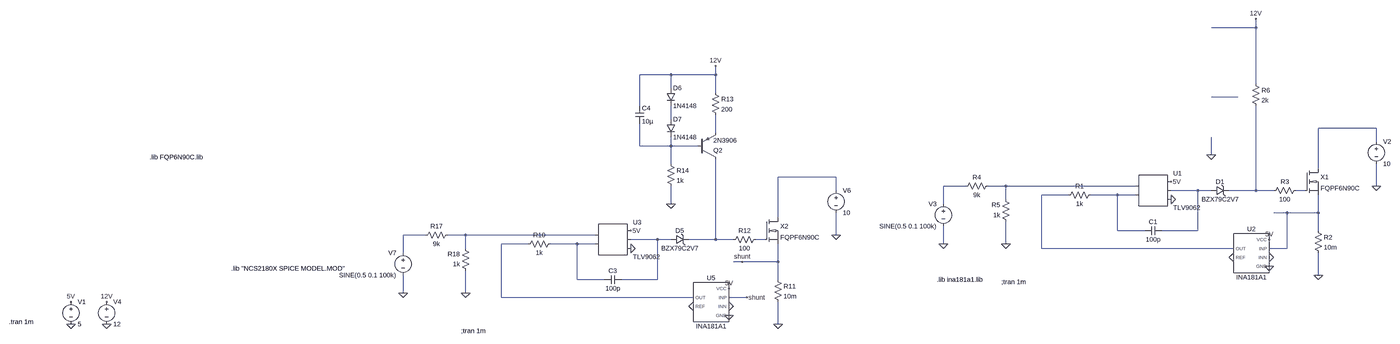
[diagram p0: schematic ina181.asc, whole sheet]
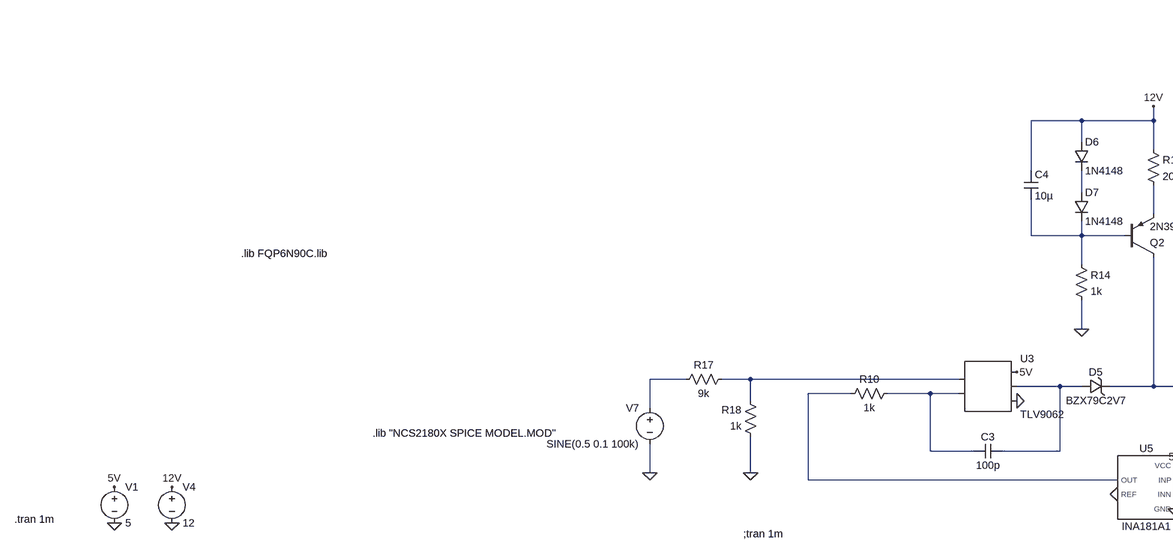
[diagram p1: schematic ina181.asc, part, row 1 of 1, column 1 of 2]
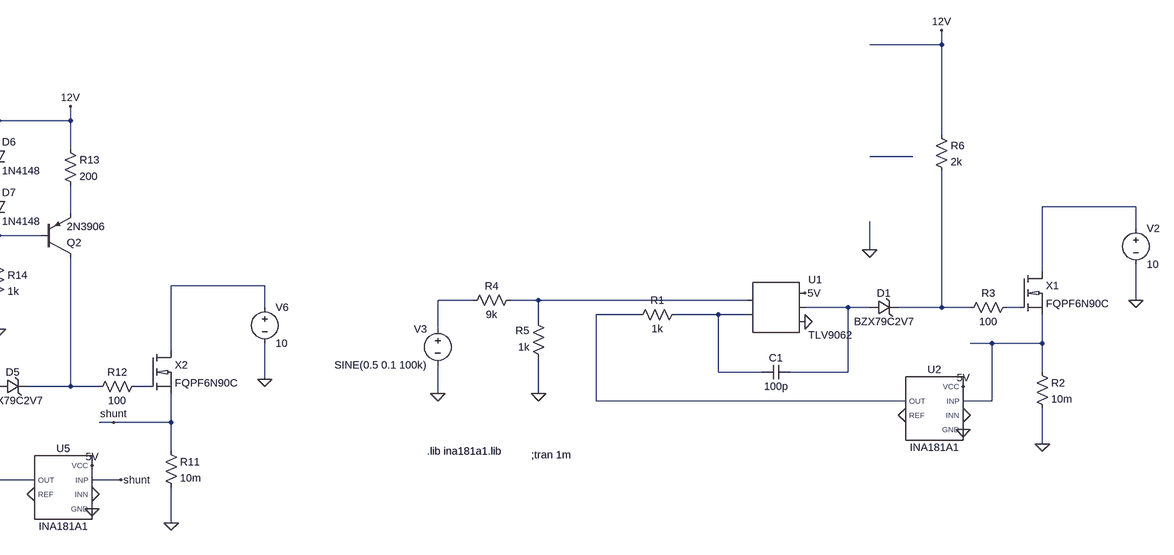
[diagram p2: schematic ina181.asc, part, row 1 of 1, column 2 of 2]
ina181.asc, the LTspice schematic file:
Version 4
SHEET 1 6072 916
WIRE 5584 -560 5584 -592
WIRE 5584 -560 5424 -560
WIRE 3344 -384 3232 -384
WIRE 3504 -384 3504 -416
WIRE 3504 -384 3344 -384
WIRE 5584 -352 5584 -560
WIRE 3344 -336 3344 -384
WIRE 3504 -320 3504 -384
WIRE 5520 -304 5424 -304
WIRE 3232 -272 3232 -384
WIRE 3344 -224 3344 -272
WIRE 6016 -192 5808 -192
WIRE 3504 -176 3504 -240
WIRE 6016 -144 6016 -192
WIRE 3232 -128 3232 -208
WIRE 3344 -128 3344 -160
WIRE 3344 -128 3232 -128
WIRE 3440 -128 3344 -128
WIRE 5424 -96 5424 -160
WIRE 3344 -64 3344 -128
WIRE 5808 -48 5808 -192
WIRE 3936 -16 3728 -16
WIRE 4544 16 4464 16
WIRE 4688 16 4624 16
WIRE 5152 16 4688 16
WIRE 6016 16 6016 -64
WIRE 3936 32 3936 -16
WIRE 5376 32 5280 32
WIRE 5424 32 5376 32
WIRE 5584 32 5584 -272
WIRE 5584 32 5488 32
WIRE 5648 32 5584 32
WIRE 5760 32 5728 32
WIRE 4912 48 4816 48
WIRE 5088 48 4992 48
WIRE 5152 48 5088 48
WIRE 4688 64 4688 16
WIRE 3344 80 3344 16
WIRE 4464 80 4464 16
WIRE 5696 112 5648 112
WIRE 5808 112 5808 48
WIRE 5808 112 5696 112
WIRE 3728 128 3728 -16
WIRE 5088 176 5088 48
WIRE 5184 176 5088 176
WIRE 5376 176 5376 32
WIRE 5376 176 5248 176
WIRE 5808 176 5808 112
WIRE 2464 192 2384 192
WIRE 2608 192 2544 192
WIRE 3072 192 2608 192
WIRE 3936 192 3936 112
WIRE 3296 208 3200 208
WIRE 3344 208 3296 208
WIRE 3504 208 3504 -80
WIRE 3504 208 3408 208
WIRE 3568 208 3504 208
WIRE 3680 208 3648 208
WIRE 2832 224 2736 224
WIRE 3008 224 2912 224
WIRE 3072 224 3008 224
WIRE 4464 224 4464 160
WIRE 4688 224 4688 144
WIRE 2608 240 2608 192
WIRE 4816 240 4816 48
WIRE 5504 240 4816 240
WIRE 5696 240 5696 112
WIRE 5696 240 5632 240
WIRE 2384 256 2384 192
WIRE 3600 288 3568 288
WIRE 3728 288 3728 224
WIRE 3728 288 3600 288
WIRE 5808 336 5808 256
WIRE 3008 352 3008 224
WIRE 3104 352 3008 352
WIRE 3296 352 3296 208
WIRE 3296 352 3168 352
WIRE 3728 352 3728 288
WIRE 2384 400 2384 336
WIRE 2608 400 2608 320
WIRE 2736 416 2736 224
WIRE 3424 416 2736 416
WIRE 3616 416 3552 416
WIRE 3728 512 3728 432
FLAG 480 432 5V
FLAG 480 512 0
FLAG 608 432 12V
FLAG 608 512 0
FLAG 3728 512 0
FLAG 3936 192 0
FLAG 3600 288 shunt
FLAG 2384 400 0
FLAG 3616 416 shunt
FLAG 3552 384 5V
FLAG 2608 400 0
FLAG 3552 448 0
FLAG 3552 480 0
FLAG 3424 448 0
FLAG 3200 240 0
FLAG 3200 176 5V
FLAG 3504 -416 12V
FLAG 3344 80 0
FLAG 5808 336 0
FLAG 6016 16 0
FLAG 4464 224 0
FLAG 5632 208 5V
FLAG 4688 224 0
FLAG 5632 272 0
FLAG 5632 304 0
FLAG 5504 272 0
FLAG 5280 64 0
FLAG 5280 0 5V
FLAG 5584 -592 12V
FLAG 5424 -96 0
SYMBOL voltage 480 416 R0
WINDOW 123 0 0 Left 0
WINDOW 39 0 0 Left 0
SYMATTR InstName V1
SYMATTR Value 5
SYMBOL voltage 608 416 R0
WINDOW 123 0 0 Left 0
WINDOW 39 0 0 Left 0
SYMATTR InstName V4
SYMATTR Value 12
SYMBOL AutoGenerated\\TLV9062 3136 208 R0
SYMATTR InstName U3
SYMBOL res 2928 208 R90
WINDOW 0 0 56 VBottom 2
WINDOW 3 32 56 VTop 2
SYMATTR InstName R10
SYMATTR Value 1k
SYMBOL cap 3168 336 R90
WINDOW 0 0 32 VBottom 2
WINDOW 3 32 32 VTop 2
SYMATTR InstName C3
SYMATTR Value 100p
SYMBOL res 3712 336 R0
SYMATTR InstName R11
SYMATTR Value 10m
SYMBOL voltage 3936 16 R0
WINDOW 123 0 0 Left 0
WINDOW 39 0 0 Left 0
SYMATTR InstName V6
SYMATTR Value 10
SYMBOL voltage 2384 240 M0
WINDOW 123 0 0 Left 0
WINDOW 39 0 0 Left 0
SYMATTR InstName V7
SYMATTR Value SINE(0.5 0.1 100k)
SYMBOL n_channel_mosfet 3680 128 R0
SYMATTR InstName X2
SYMBOL res 3664 192 R90
WINDOW 0 0 56 VBottom 2
WINDOW 3 32 56 VTop 2
SYMATTR InstName R12
SYMATTR Value 100
SYMBOL res 2560 176 R90
WINDOW 0 0 56 VBottom 2
WINDOW 3 32 56 VTop 2
SYMATTR InstName R17
SYMATTR Value 9k
SYMBOL res 2624 336 R180
WINDOW 0 36 76 Left 2
WINDOW 3 36 40 Left 2
SYMATTR InstName R18
SYMATTR Value 1k
SYMBOL INA181A1 3488 448 M0
SYMATTR InstName U5
SYMBOL zener 3344 224 R270
WINDOW 0 32 32 VTop 2
WINDOW 3 0 32 VBottom 2
SYMATTR InstName D5
SYMATTR Value BZX79C2V7
SYMATTR Description Diode
SYMATTR Type diode
SYMBOL pnp 3440 -80 M180
SYMATTR InstName Q2
SYMATTR Value 2N3906
SYMBOL res 3488 -336 R0
SYMATTR InstName R13
SYMATTR Value 200
SYMBOL diode 3328 -336 R0
SYMATTR InstName D6
SYMATTR Value 1N4148
SYMBOL diode 3328 -224 R0
SYMATTR InstName D7
SYMATTR Value 1N4148
SYMBOL cap 3216 -272 R0
SYMATTR InstName C4
SYMATTR Value 10µ
SYMBOL res 3328 -80 R0
SYMATTR InstName R14
SYMATTR Value 1k
SYMBOL AutoGenerated\\TLV9062 5216 32 R0
SYMATTR InstName U1
SYMBOL res 5008 32 R90
WINDOW 0 0 56 VBottom 2
WINDOW 3 32 56 VTop 2
SYMATTR InstName R1
SYMATTR Value 1k
SYMBOL cap 5248 160 R90
WINDOW 0 0 32 VBottom 2
WINDOW 3 32 32 VTop 2
SYMATTR InstName C1
SYMATTR Value 100p
SYMBOL res 5792 160 R0
SYMATTR InstName R2
SYMATTR Value 10m
SYMBOL voltage 6016 -160 R0
WINDOW 123 0 0 Left 0
WINDOW 39 0 0 Left 0
SYMATTR InstName V2
SYMATTR Value 10
SYMBOL voltage 4464 64 M0
WINDOW 123 0 0 Left 0
WINDOW 39 0 0 Left 0
SYMATTR InstName V3
SYMATTR Value SINE(0.5 0.1 100k)
SYMBOL n_channel_mosfet 5760 -48 R0
SYMATTR InstName X1
SYMBOL res 5744 16 R90
WINDOW 0 0 56 VBottom 2
WINDOW 3 32 56 VTop 2
SYMATTR InstName R3
SYMATTR Value 100
SYMBOL res 4640 0 R90
WINDOW 0 0 56 VBottom 2
WINDOW 3 32 56 VTop 2
SYMATTR InstName R4
SYMATTR Value 9k
SYMBOL res 4704 160 R180
WINDOW 0 36 76 Left 2
WINDOW 3 36 40 Left 2
SYMATTR InstName R5
SYMATTR Value 1k
SYMBOL INA181A1 5568 272 M0
SYMATTR InstName U2
SYMBOL zener 5424 48 R270
WINDOW 0 32 32 VTop 2
WINDOW 3 0 32 VBottom 2
SYMATTR InstName D1
SYMATTR Value BZX79C2V7
SYMATTR Description Diode
SYMATTR Type diode
SYMBOL res 5568 -368 R0
SYMATTR InstName R6
SYMATTR Value 2k
TEXT -304 504 Left 2 !.tran 1m
TEXT 1192 -88 Left 2 !.lib FQP6N90C.lib
TEXT 1768 312 Left 2 !.lib "NCS2180X SPICE MODEL.MOD"
TEXT 2592 536 Left 2 !;tran 1m
TEXT 4440 352 Left 2 !.lib ina181a1.lib
TEXT 4672 360 Left 2 !;tran 1m

The netlist it stands for:
* ina181.asc
V1 5V 0 5
V4 12V 0 12
* U3: TLV9062 (symbol AutoGenerated\TLV9062 not available, pins judged from their places): pin1=N016 pin2=N021 pin3=5V pin4=N017 pin5=0
R10 N021 N020 1k
C3 N017 N021 100p
R11 shunt 0 10m
V6 N006 0 10
V7 N015 0 SINE(0.5 0.1 100k)
XX2 N006 N019 shunt FQPF6N90C  ; pins D G S
R12 N019 N018 100
R17 N016 N015 9k
R18 0 N016 1k
XU5 shunt 0 5V 0 0 N020 INA181A1  ; pins INP INN VCC GND REF OUT
D5 N017 N018 BZX79C2V7
Q2 N018 N005 N004 0 2N3906
R13 12V N004 200
D6 12V N002 1N4148
D7 N002 N005 1N4148
C4 12V N005 10µ
R14 N005 0 1k
* U1: TLV9062 (symbol AutoGenerated\TLV9062 not available, pins judged from their places): pin1=N008 pin2=N013 pin3=5V pin4=N009 pin5=0
R1 N013 N012 1k
C1 N009 N013 100p
R2 N014 0 10m
V2 N003 0 10
V3 N007 0 SINE(0.5 0.1 100k)
XX1 N003 N011 N014 FQPF6N90C  ; pins D G S
R3 N011 N010 100
R4 N008 N007 9k
R5 0 N008 1k
XU2 N014 0 5V 0 0 N012 INA181A1  ; pins INP INN VCC GND REF OUT
D1 N009 N010 BZX79C2V7
R6 12V N010 2k
.model D D
.lib standard.dio
.model NPN NPN
.model PNP PNP
.lib standard.bjt
.tran 1m
.lib FQP6N90C.lib
.lib "NCS2180X SPICE MODEL.MOD"
;tran 1m
.lib ina181a1.lib
;tran 1m
.lib FQP6N90C.lib
.lib ina181a1.lib
.backanno
.end